# Altium project Template.PrjPcb
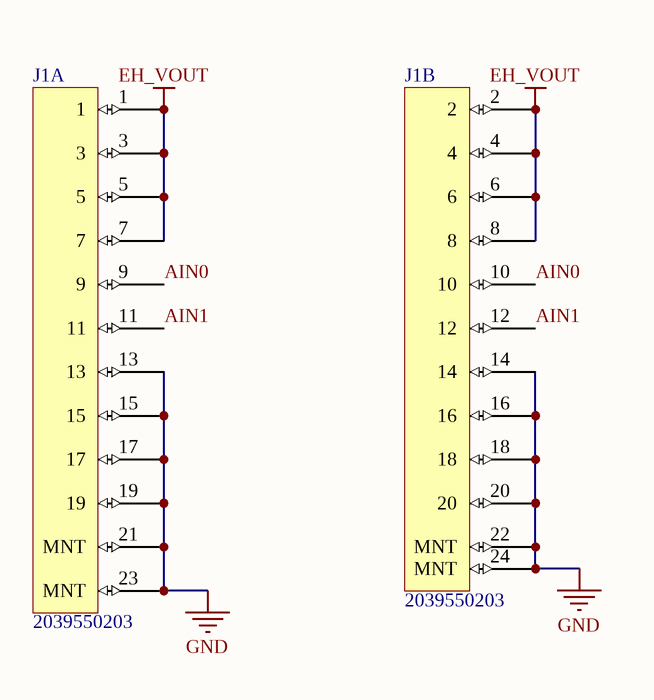
[diagram p0: Sheet1.SchDoc]
1 sheet, 1 parts. Net scope: global (net labels, ports and power ports of the same name join across sheets).
Board file: PCB1.PcbDoc

## Sheet Sheet1.SchDoc
size A; SheetNumber: 1; SheetTotal: 1

### Parts
J1  2039550203  [2039550203]  (parts A,B of 2)

### Nets
EH_VOUT: J1.1 J1.2 J1.3 J1.4 J1.5 J1.6 J1.7 J1.8
GND: J1.13 J1.14 J1.15 J1.16 J1.17 J1.18 J1.19 J1.20 J1.21(MNT) J1.22(MNT) J1.23(MNT) J1.24(MNT)
AIN0: J1.9 J1.10
AIN1: J1.11 J1.12